# EasyEDA Pro project ESD_System.eprj, board PCB6
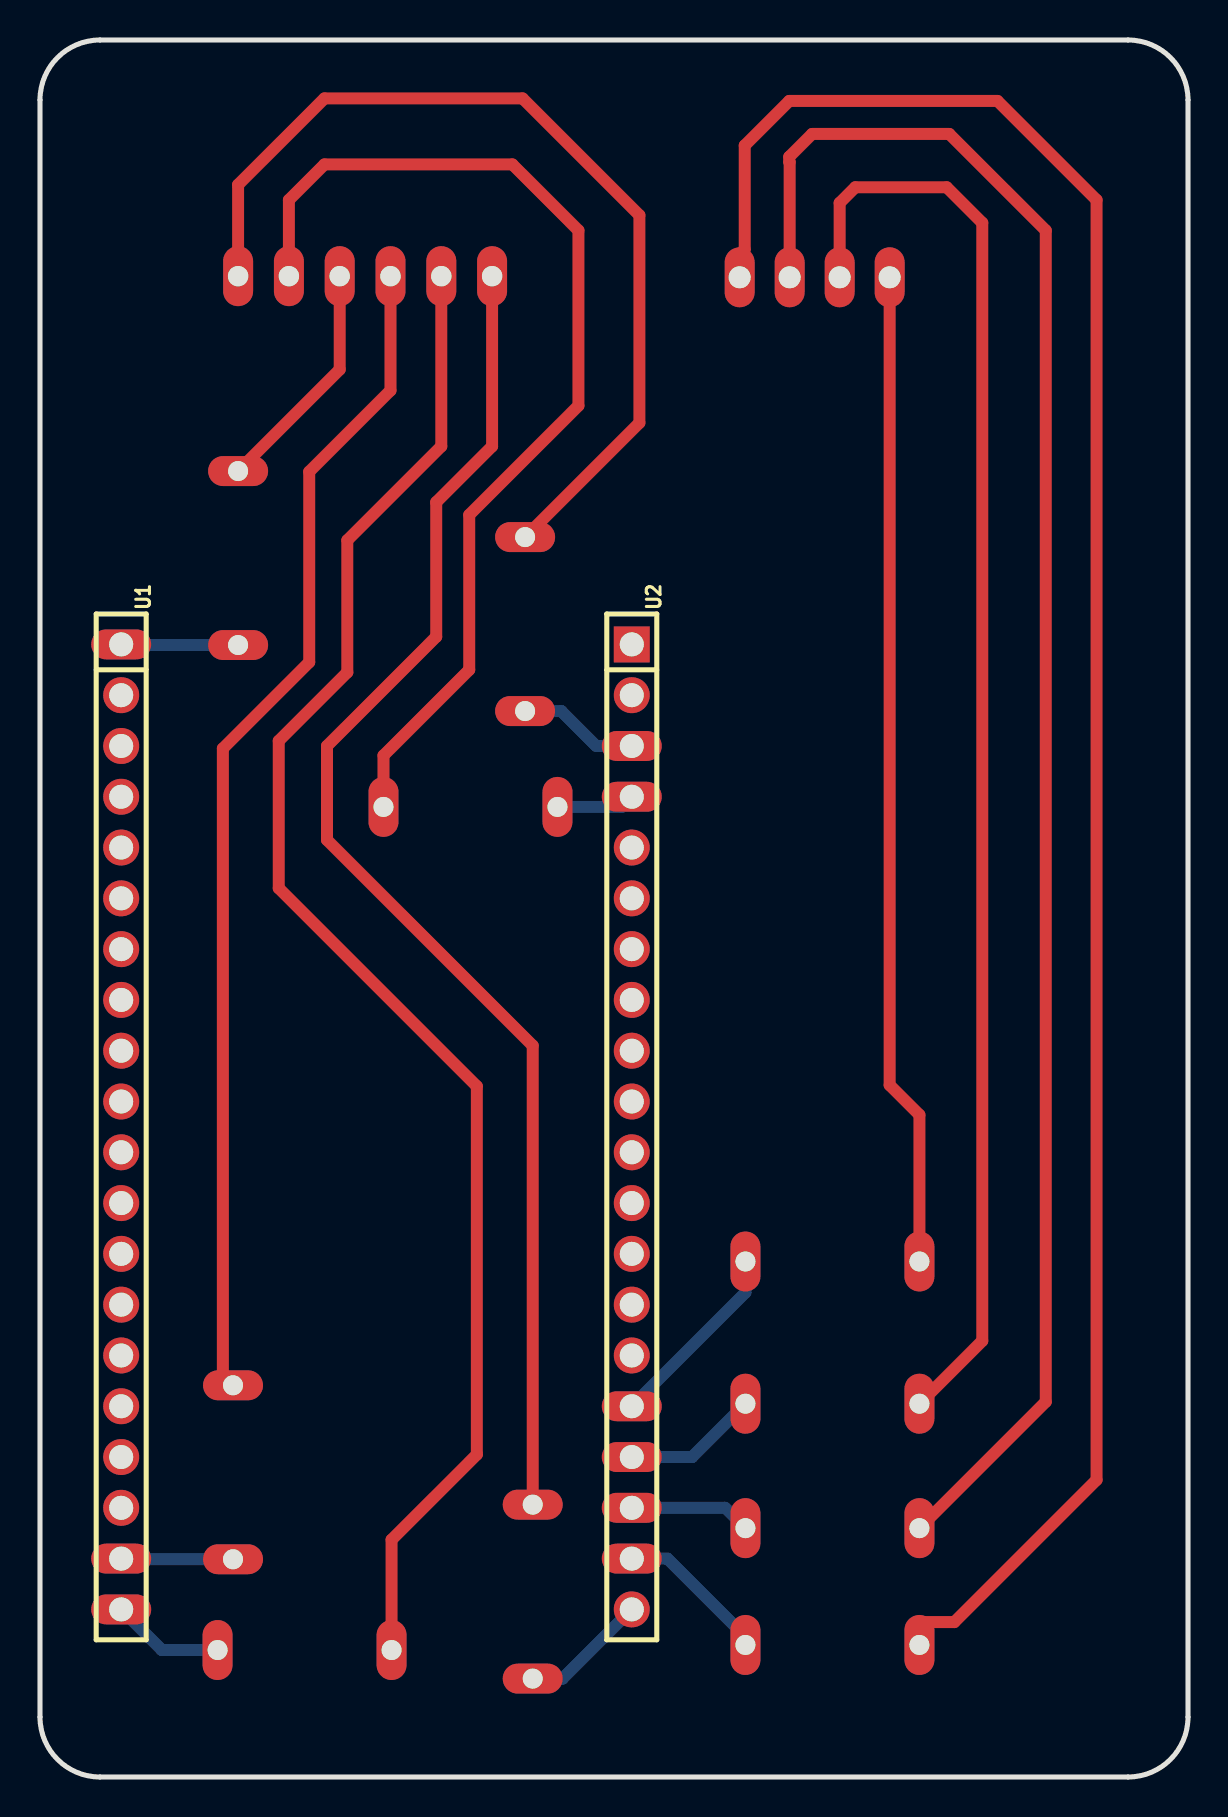
[diagram p8: board, top side]
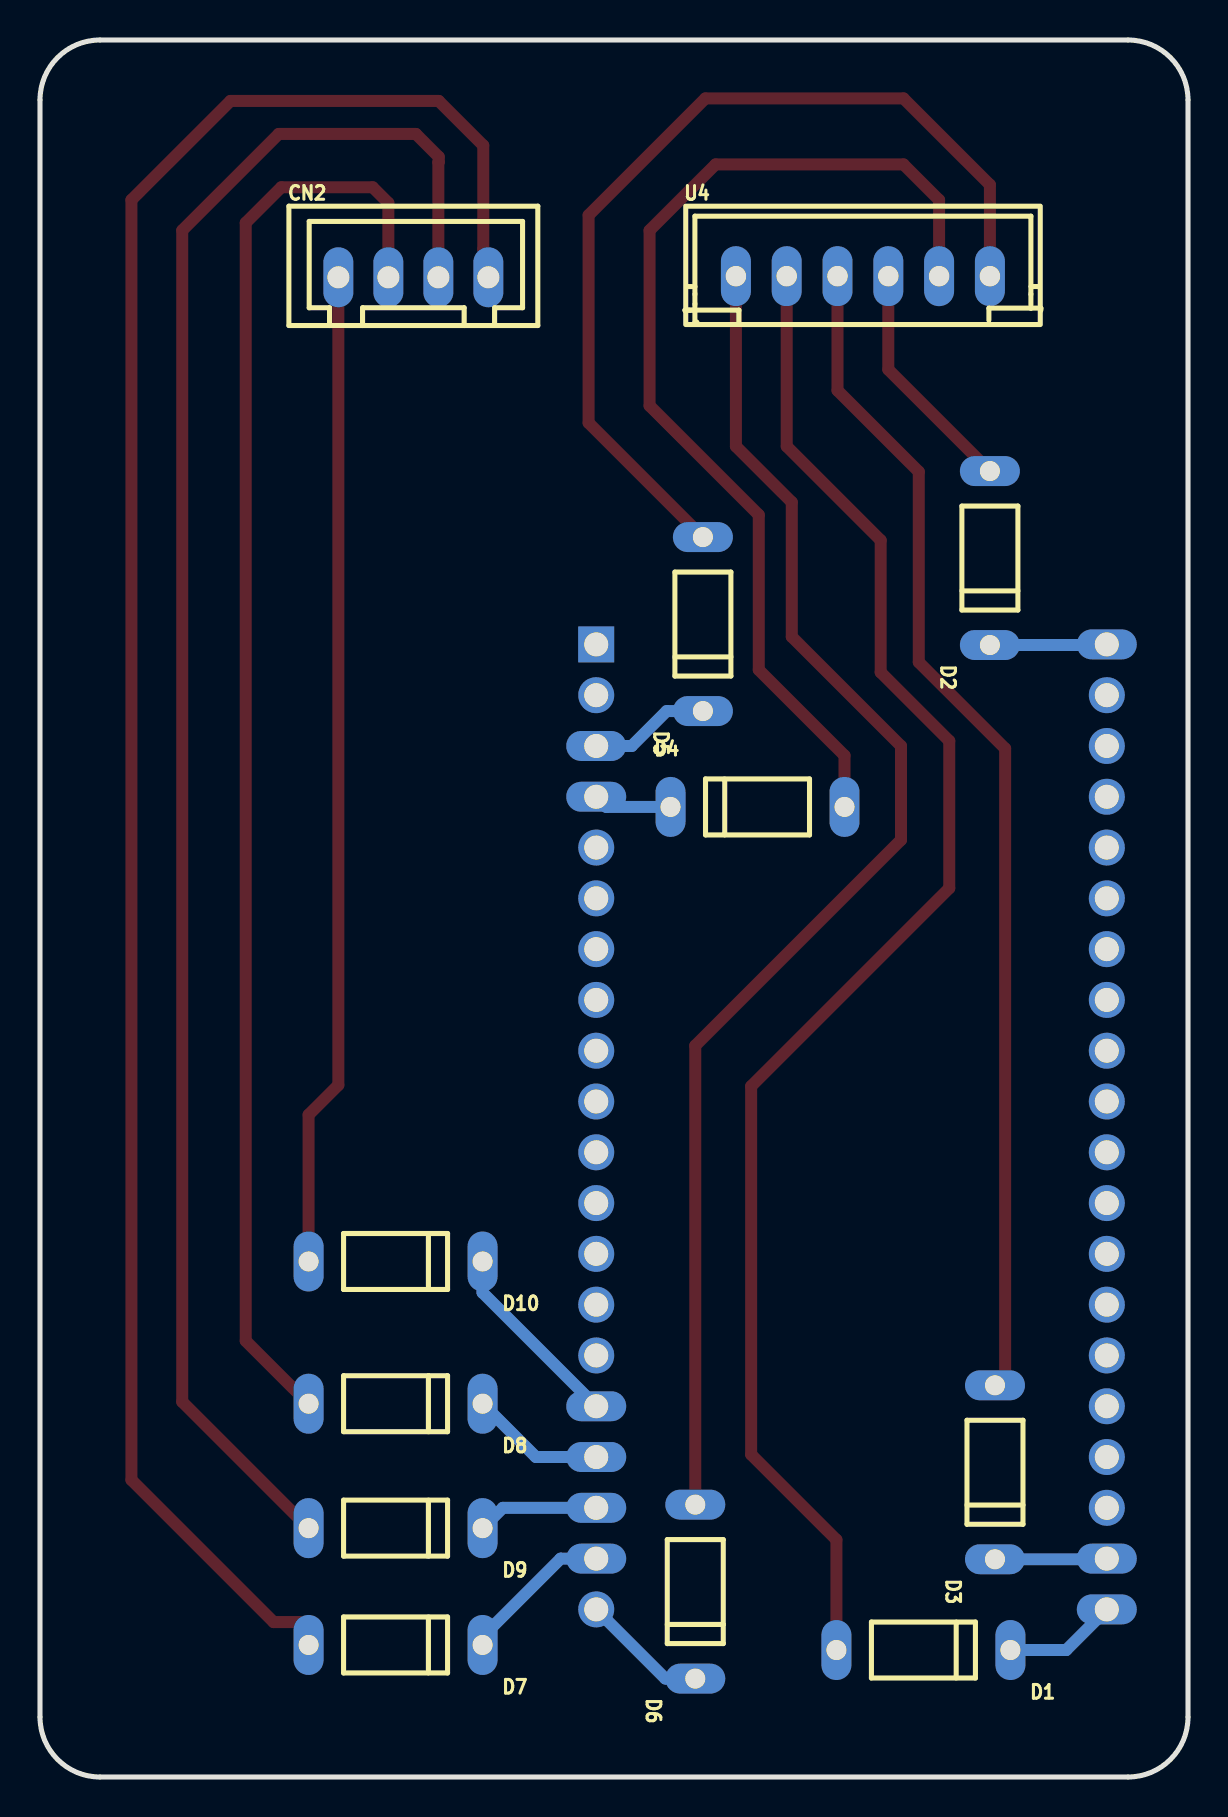
[diagram p9: board, bottom side, seen from below]

Outline 57.4 x 86.87 mm; copper layers: Top Layer, Bottom Layer. Coordinates in mm from the lower left corner of the outline.
Outline path: 0,83.87 0,3 arc(0.88,0.88) 3,0 54.4,0 arc(56.53,0.88) 57.4,3 57.4,83.87 arc(56.53,85.99) 54.4,86.87 3,86.87 arc(0.88,85.99) 0,83.87
Stack: Top Layer 0.035mm / Dielectric1 1.51mm FR4 er 4.5 / Bottom Layer 0.035mm

## Design rules (mm)
template: JLCPCB Capability(Two Layers Board)
spacing copperThickness1oz (default): track to track 0.102, other pairs 0.152 to 0.3
spacing copperThickness2oz: track to track 0.203, other pairs 0.152 to 0.3
track width copperThickness1oz (default): min 0.127, default 0.254, max 2.54
track width copperThickness2oz: min 0.203, default 0.254, max 2.54
differential pair differentialPair (default): width min 0.127, default 0.254, max 2.54; gap min 0.152, default 0.152
via viaSize (default): diameter min 0.5, default 0.61, max 10; hole min 0.3, default 0.305, max 6.3

## Placement (name value [footprint] x y rotation side)
CN2  ZX-XH2.54-4PZZ  [CONN-TH_4P-P2.50_4PIN]  38.74 75 180 bottom
D1  1N4001  [DO-41_BD2.4-L4.7-P8.70-D0.9-RD]  13.23 6.35 0 bottom
D2  1N4001  [DO-41_BD2.4-L4.7-P8.70-D0.9-RD]  9.91 60.96 90 bottom
D3  1N4001  [DO-41_BD2.4-L4.7-P8.70-D0.9-RD]  9.65 15.24 90 bottom
D4  1N4001  [DO-41_BD2.4-L4.7-P8.70-D0.9-RD]  21.53 48.51 180 bottom
D5  1N4001  [DO-41_BD2.4-L4.7-P8.70-D0.9-RD]  24.26 57.66 90 bottom
D6  1N4001  [DO-41_BD2.4-L4.7-P8.70-D0.9-RD]  24.64 9.27 90 bottom
D7  1N4001  [DO-41_BD2.4-L4.7-P8.70-D0.9-RD]  39.62 6.6 0 bottom
D8  1N4001  [DO-41_BD2.4-L4.7-P8.70-D0.9-RD]  39.62 18.67 0 bottom
D9  1N4001  [DO-41_BD2.4-L4.7-P8.70-D0.9-RD]  39.62 12.45 0 bottom
D10  1N4001  [DO-41_BD2.4-L4.7-P8.70-D0.9-RD]  39.62 25.78 0 bottom
NOREF  -  [Pad_e397]  2.69 3 270 top
NOREF#2  -  [Pad_e389]  54.4 83.87 270 top
NOREF#3  -  [Pad_e401]  54.4 3 270 top
NOREF#4  -  [Pad_e393]  3 83.87 270 top
U1  ZX-PM2.54-1-20PY  [HDR-TH_20P-P2.54-V-F]  4.06 32.51 270 top
U2  ZX-PM2.54-1-20PY  [HDR-TH_20P-P2.54-V-F#2]  29.59 32.51 270 top
U4  ZX-XH2.54-6PZZ-Y  [CONN-TH_6P-P2.54_C9900015703]  16.26 75.06 180 bottom

## Footprints (pads in the part's own frame, mm; a bottom-side part is the same pattern mirrored in y, then rotated)
CONN-TH_4P-P2.50_4PIN
  oval 1.5x3 hole 1.1: 1(-3.75,0) 2(-1.25,0) 3(1.25,0) 4(3.75,0)
CONN-TH_6P-P2.54_C9900015703
  oval 1.5x3 hole 1.02: 1(-6.35,0) 2(-3.81,0) 3(-1.27,0) 4(1.27,0) 5(3.81,0) 6(6.35,0)
DO-41_BD2.4-L4.7-P8.70-D0.9-RD
  oval 1.5x3 hole 1: 1(-4.35,0) 2(4.35,0)
HDR-TH_20P-P2.54-V-F
  oval 1.5x3 hole 1.2: 1(-24.13,0) 19(21.59,0) 20(24.13,0)
  round 1.8 hole 1.2: 2(-21.59,0) 3(-19.05,0) 4(-16.51,0) 5(-13.97,0) 6(-11.43,0) 7(-8.89,0) 8(-6.35,0) 9(-3.81,0) 10(-1.27,0) 11(1.27,0) 12(3.81,0) 13(6.35,0) 14(8.89,0) 15(11.43,0) 16(13.97,0) 17(16.51,0) 18(19.05,0)
HDR-TH_20P-P2.54-V-F#2
  rect 1.8x1.8 hole 1.2: 1(-24.13,0)
  round 1.8 hole 1.2: 2(-21.59,0) 5(-13.97,0) 6(-11.43,0) 7(-8.89,0) 8(-6.35,0) 9(-3.81,0) 10(-1.27,0) 11(1.27,0) 12(3.81,0) 13(6.35,0) 14(8.89,0) 15(11.43,0) 20(24.13,0)
  oval 1.5x3 hole 1.2: 3(-19.05,0) 4(-16.51,0) 16(13.97,0) 17(16.51,0) 18(19.05,0) 19(21.59,0)
Pad_e389
  round 0.003 hole 3: 1(0,0)
Pad_e393
  round 0.003 hole 3: 1(0,0)
Pad_e397
  round 0.003 hole 3: 1(0,0)
Pad_e401
  round 0.003 hole 3: 1(0,0)

## Nets
As in the schematic, except:
$1N1659: D3.1 NOREF.1 NOREF#2.1 NOREF#3.1 NOREF#4.1 U1.19

Pads without a net: U1 2 3 4 5 6 7 8 9 10 11 12 13 14 15 16 17 18; U2 1 2 5 6 7 8 9 10 11 12 13 14 15

## Routing (per net, layer and track width the routed paths; a pad name or vN(x,y) marks a point on that pad's centre or on a via; arc(x,y) is an arc through that point)
$1N546: length 5.7
  Bottom Layer w0.6: U1.20 6.09,6.35 D1.1
$1N551: length 77.9
  Top Layer w0.6: U4.2 20.07,66.55 15.37,61.85 15.37,55.25 11.94,51.82 11.94,44.45 21.84,34.54 21.84,16.13 17.58,11.87 D1.2
$1N1659: length 5.6
  Bottom Layer w0.6: 4.06,10.92 4.09,10.89 D3.1
$1N1663: length 59.1
  Top Layer w0.6: U4.3 17.53,69.34 13.46,65.28 13.46,55.75 9.14,51.44 9.14,20.1 D3.2
$1N1681: length 5.9
  Bottom Layer w0.6: D2.1 4.09,56.61 U1.1
$1N1686: length 11.9
  Top Layer w0.6: U4.4 14.99,70.39 D2.2
$1N1690: length 53.3
  Top Layer w0.6: U4.5 12.45,78.87 14.22,80.65 23.62,80.65 26.92,77.34 26.92,68.58 21.46,63.12 21.46,55.37 17.18,51.08 D4.2
$1N1696: length 3.9
  Bottom Layer w0.6: D4.1 29.08,48.51 29.59,49.02
$1N1699: length 47.3
  Top Layer w0.6: U4.6 9.91,79.63 14.22,83.95 24.13,83.95 29.97,78.11 29.97,67.72 24.26,62.01
$1N1705: length 6.1
  Bottom Layer w0.6: U2.3 27.81,51.56 26.07,53.31 D5.1
$1N1809: length 69.1
  Top Layer w0.6: U4.1 22.61,66.55 19.81,63.75 19.81,57.02 14.35,51.56 14.35,46.86 24.64,36.58 D6.2
$1N1813: length 6.4
  Bottom Layer w0.6: U2.20 26.13,4.92 D6.1
$1N2019: length 49.8
  Top Layer w0.6: CN2.1 42.49,34.6 43.97,33.12 D10.2
$1N2024: length 72.3
  Top Layer w0.6: D8.2 47.12,21.81 47.12,77.72 45.34,79.5 40.77,79.5 39.99,78.72 CN2.2
$1N2034: length 88.8
  Top Layer w0.6: CN2.3 37.49,80.75 37.47,80.77 37.47,81.03 38.61,82.17 45.47,82.17 50.29,77.34 50.29,18.76 D9.2
$1N2041: length 104.2
  Top Layer w0.6: CN2.4 34.99,76.14 35.24,76.4 35.24,81.59 37.47,83.82 47.88,83.82 52.83,78.87 52.83,14.86 45.72,7.75 43.97,7.75 D7.2
$1N2048: length 7.7
  Bottom Layer w0.6: D7.1 35.27,7.02 31.37,10.92 29.59,10.92
$1N2054: length 6.1
  Bottom Layer w0.6: U2.18 34.26,13.46 D9.1
$1N2061: length 6.8
  Bottom Layer w0.6: D8.1 32.61,16 U2.17
$1N2068: length 9.6
  Bottom Layer w0.6: 29.59,18.54 35.27,24.23 D10.1
